# Altium schematic sheet FPGA_Connectors.SchDoc: FPGA Connectors
size 279 x 215 mm; DrawnBy: Connor Dack; Engineer: Connor Dack; DocumentNumber: 6; Revision: 1.0; SheetNumber: 6; SheetTotal: 11
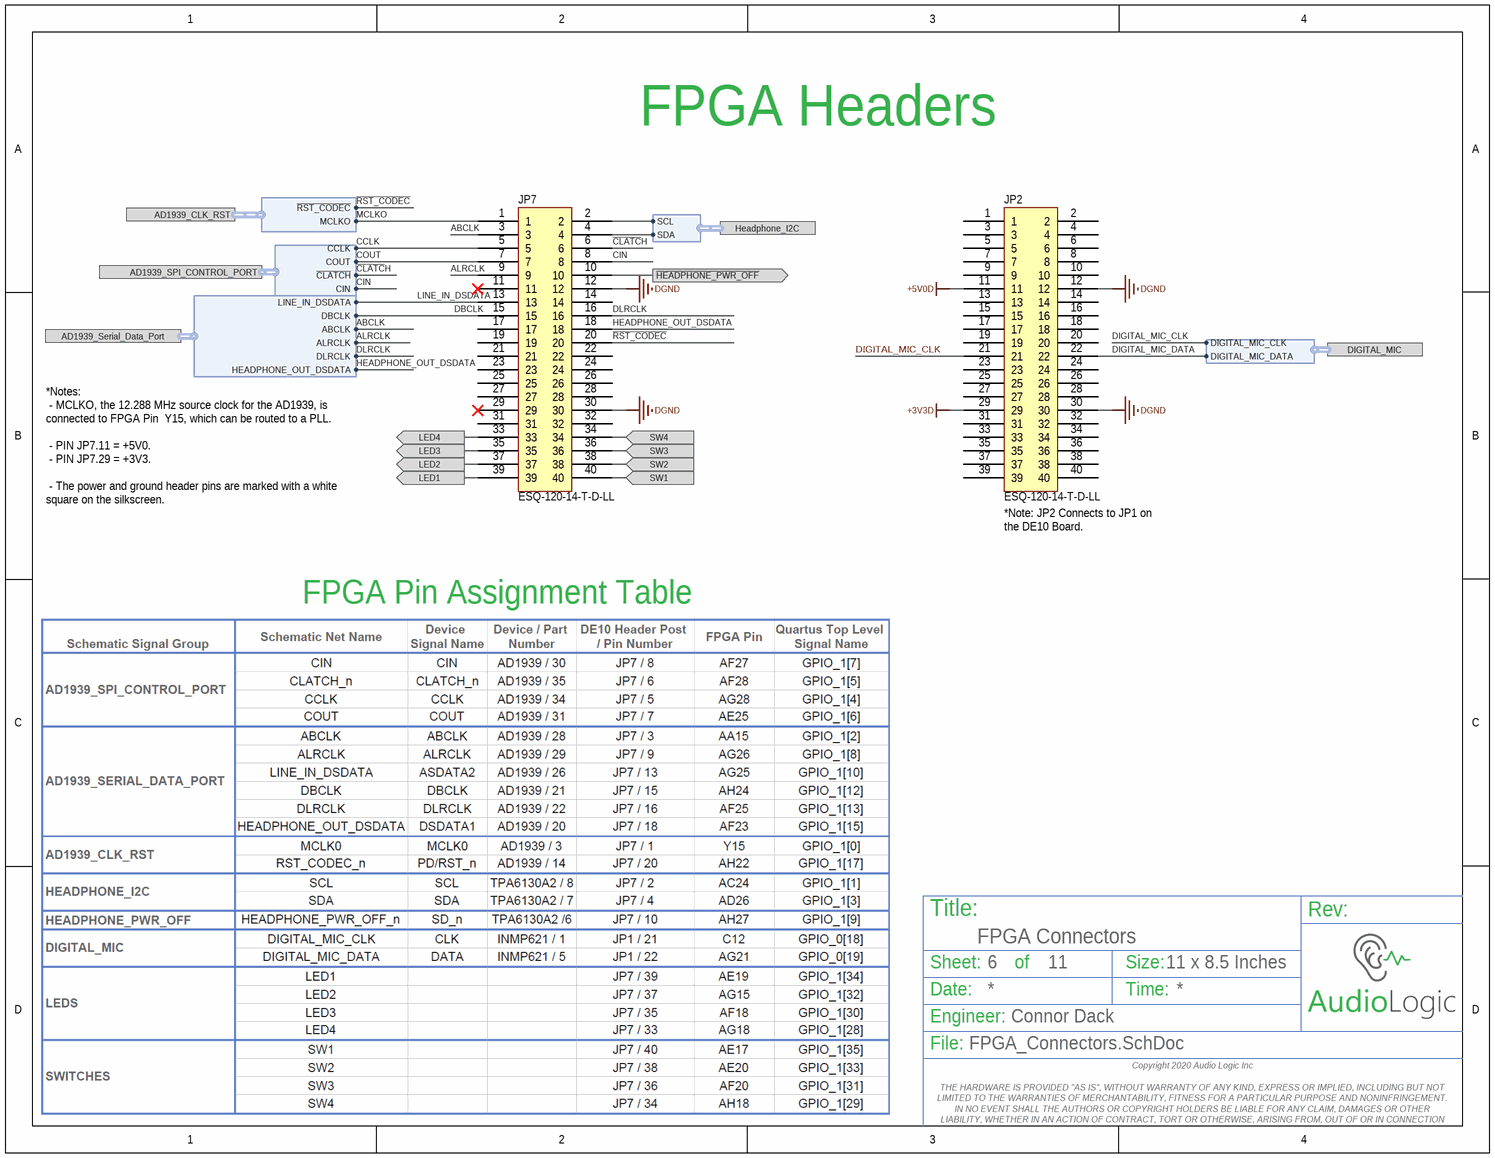
[diagram p0: FPGA_Connectors.SchDoc]

## Parts
JP2  ESQ-120-14-T-D-LL  [ESQ-120-24-T-D-LL]
JP7  ESQ-120-14-T-D-LL  [ESQ-120-24-T-D-LL]

## Ports
AD1939_CLK_RST (harness AD1939_CLK_RST), AD1939_Serial_Data_Port (harness AD19319_Serial_Data_Port), AD1939_SPI_CONTROL_PORT (harness SPI_Audio_Codec), DIGITAL_MIC (harness Digital_Mic), Headphone_I2C (harness I2C_Headphone), LED1 (out), LED2 (out), LED3 (out), LED4 (out), SW1 (in), SW2 (in), SW3 (in), SW4 (in), ~{HEADPHONE_PWR_OFF} (out)

## Harnesses
I2C_Headphone: SDA, SCL
SPI_Audio_Codec: CIN, COUT, CCLK, ~{CLATCH}
AD19319_Serial_Data_Port: ABCLK, ALRCLK, LINE_IN_DSDATA, DLRCLK, DBCLK, HEADPHONE_OUT_DSDATA
Digital_Mic: DIGITAL_MIC_CLK, DIGITAL_MIC_DATA
AD1939_CLK_RST: ~{RST_CODEC}, MCLKO

## Nets
+3V3D: JP2.29
+5V0D: JP2.11
DGND: JP2.12 JP2.30 JP7.12 JP7.30
~{CLATC}H: JP7.6 ; port AD1939_SPI_CONTROL_PORT.~{CLATCH}
ABCLK: JP7.3 ; port AD1939_Serial_Data_Port.ABCLK
ALRCLK: JP7.9 ; port AD1939_Serial_Data_Port.ALRCLK
CCLK: JP7.5 ; port AD1939_SPI_CONTROL_PORT.CCLK
CIN: JP7.8 ; port AD1939_SPI_CONTROL_PORT.CIN
COUT: JP7.7 ; port AD1939_SPI_CONTROL_PORT.COUT
DBCLK: JP7.15 ; port AD1939_Serial_Data_Port.DBCLK
DIGITAL_MIC_CLK: JP2.21 ; port DIGITAL_MIC.DIGITAL_MIC_CLK
DIGITAL_MIC_DATA: JP2.22 ; port DIGITAL_MIC.DIGITAL_MIC_DATA
DLRCLK: JP7.16 ; port AD1939_Serial_Data_Port.DLRCLK
~{HEADPHONE_PWR_OFF}: JP7.10 ; port ~{HEADPHONE_PWR_OFF}
HEADPHONE_OUT_DSDATA: JP7.18 ; port AD1939_Serial_Data_Port.HEADPHONE_OUT_DSDATA
LED1: JP7.39 ; port LED1
LED2: JP7.37 ; port LED2
LED3: JP7.35 ; port LED3
LED4: JP7.33 ; port LED4
LINE_IN_DSDATA: JP7.13 ; port AD1939_Serial_Data_Port.LINE_IN_DSDATA
MCLKO: JP7.1 ; port AD1939_CLK_RST.MCLKO
~{RST_CODEC}: JP7.20 ; port AD1939_CLK_RST.~{RST_CODEC}
SW1: JP7.40 ; port SW1
SW2: JP7.38 ; port SW2
SW3: JP7.36 ; port SW3
SW4: JP7.34 ; port SW4
NetJP7_2: JP7.2 ; port Headphone_I2C.SCL
NetJP7_4: JP7.4 ; port Headphone_I2C.SDA

Not connected (* = marked no-connect by the designer): JP2 1 2 3 4 5 6 7 8 9 10 13 14 15 16 17 18 19 20 23 24 25 26 27 28 31 32 33 34 35 36 37 38 39 40; JP7 11* 14 17 19 21 22 23 24 25 26 27 28 29* 31 32

## Notes on the sheet
- FPGA Headers
- *Notes:
  - MCLKO, the 12.288 MHz source clock for the AD1939, is connected to FPGA Pin  Y15, which can be routed to a PLL.
  - PIN JP7.11 = +5V0.
  - PIN JP7.29 = +3V3.
  - The power and ground header pins are marked with a white square on the silkscreen.
- (near JP2) *Note: JP2 Connects to JP1 on the DE10 Board.
- FPGA Pin Assignment Table
- Title:
- Sheet:
- of
- Size:
- 11 x 8.5 Inches
- Rev:
- Date:
- Engineer:
- Time:
- File:
- Copyright 2020 Audio Logic Inc
  THE HARDWARE IS PROVIDED "AS IS", WITHOUT WARRANTY OF ANY KIND, EXPRESS OR IMPLIED, INCLUDING BUT NOT LIMITED TO THE WARRANTIES OF MERCHANTABILITY, FITNESS FOR A PARTICULAR PURPOSE AND NONINFRINGEMENT. IN NO EVENT SHALL THE AUTHORS OR COPYRIGHT HOLDERS BE LIABLE FOR ANY CLAIM, DAMAGES OR OTHER LIABILITY, WHETHER IN AN ACTION OF CONTRACT, TORT OR OTHERWISE, ARISING FROM, OUT OF OR IN CONNECTION WITH THE HARDWARE OR THE USE OR OTHER DEALINGS IN THE HARDWARE.

## Library data of the parts
JP2 JP7 = CON_TH_0D100P_2x20: Female to Male 0D100P 2x20 Connector; Manufacturer: Samtec; LatestRevisionDate: 17-Jul-2002; LatestRevisionNote: Re-released for DXP Platform.; Publisher: Altium Limited; Manufacturer Part Number: ESQ-120-14-T-D-LL; Supplier 1: Samtec; Supplier Part Number 1: ESQ-120-14-T-D-LL; Load Status: *